# EasyEDA schematic Lesson1.2.json
TITLE: Sheet_1; REV: 1.0; Date: 2022-12-04; Sheet: 1/1; Company: Your Company
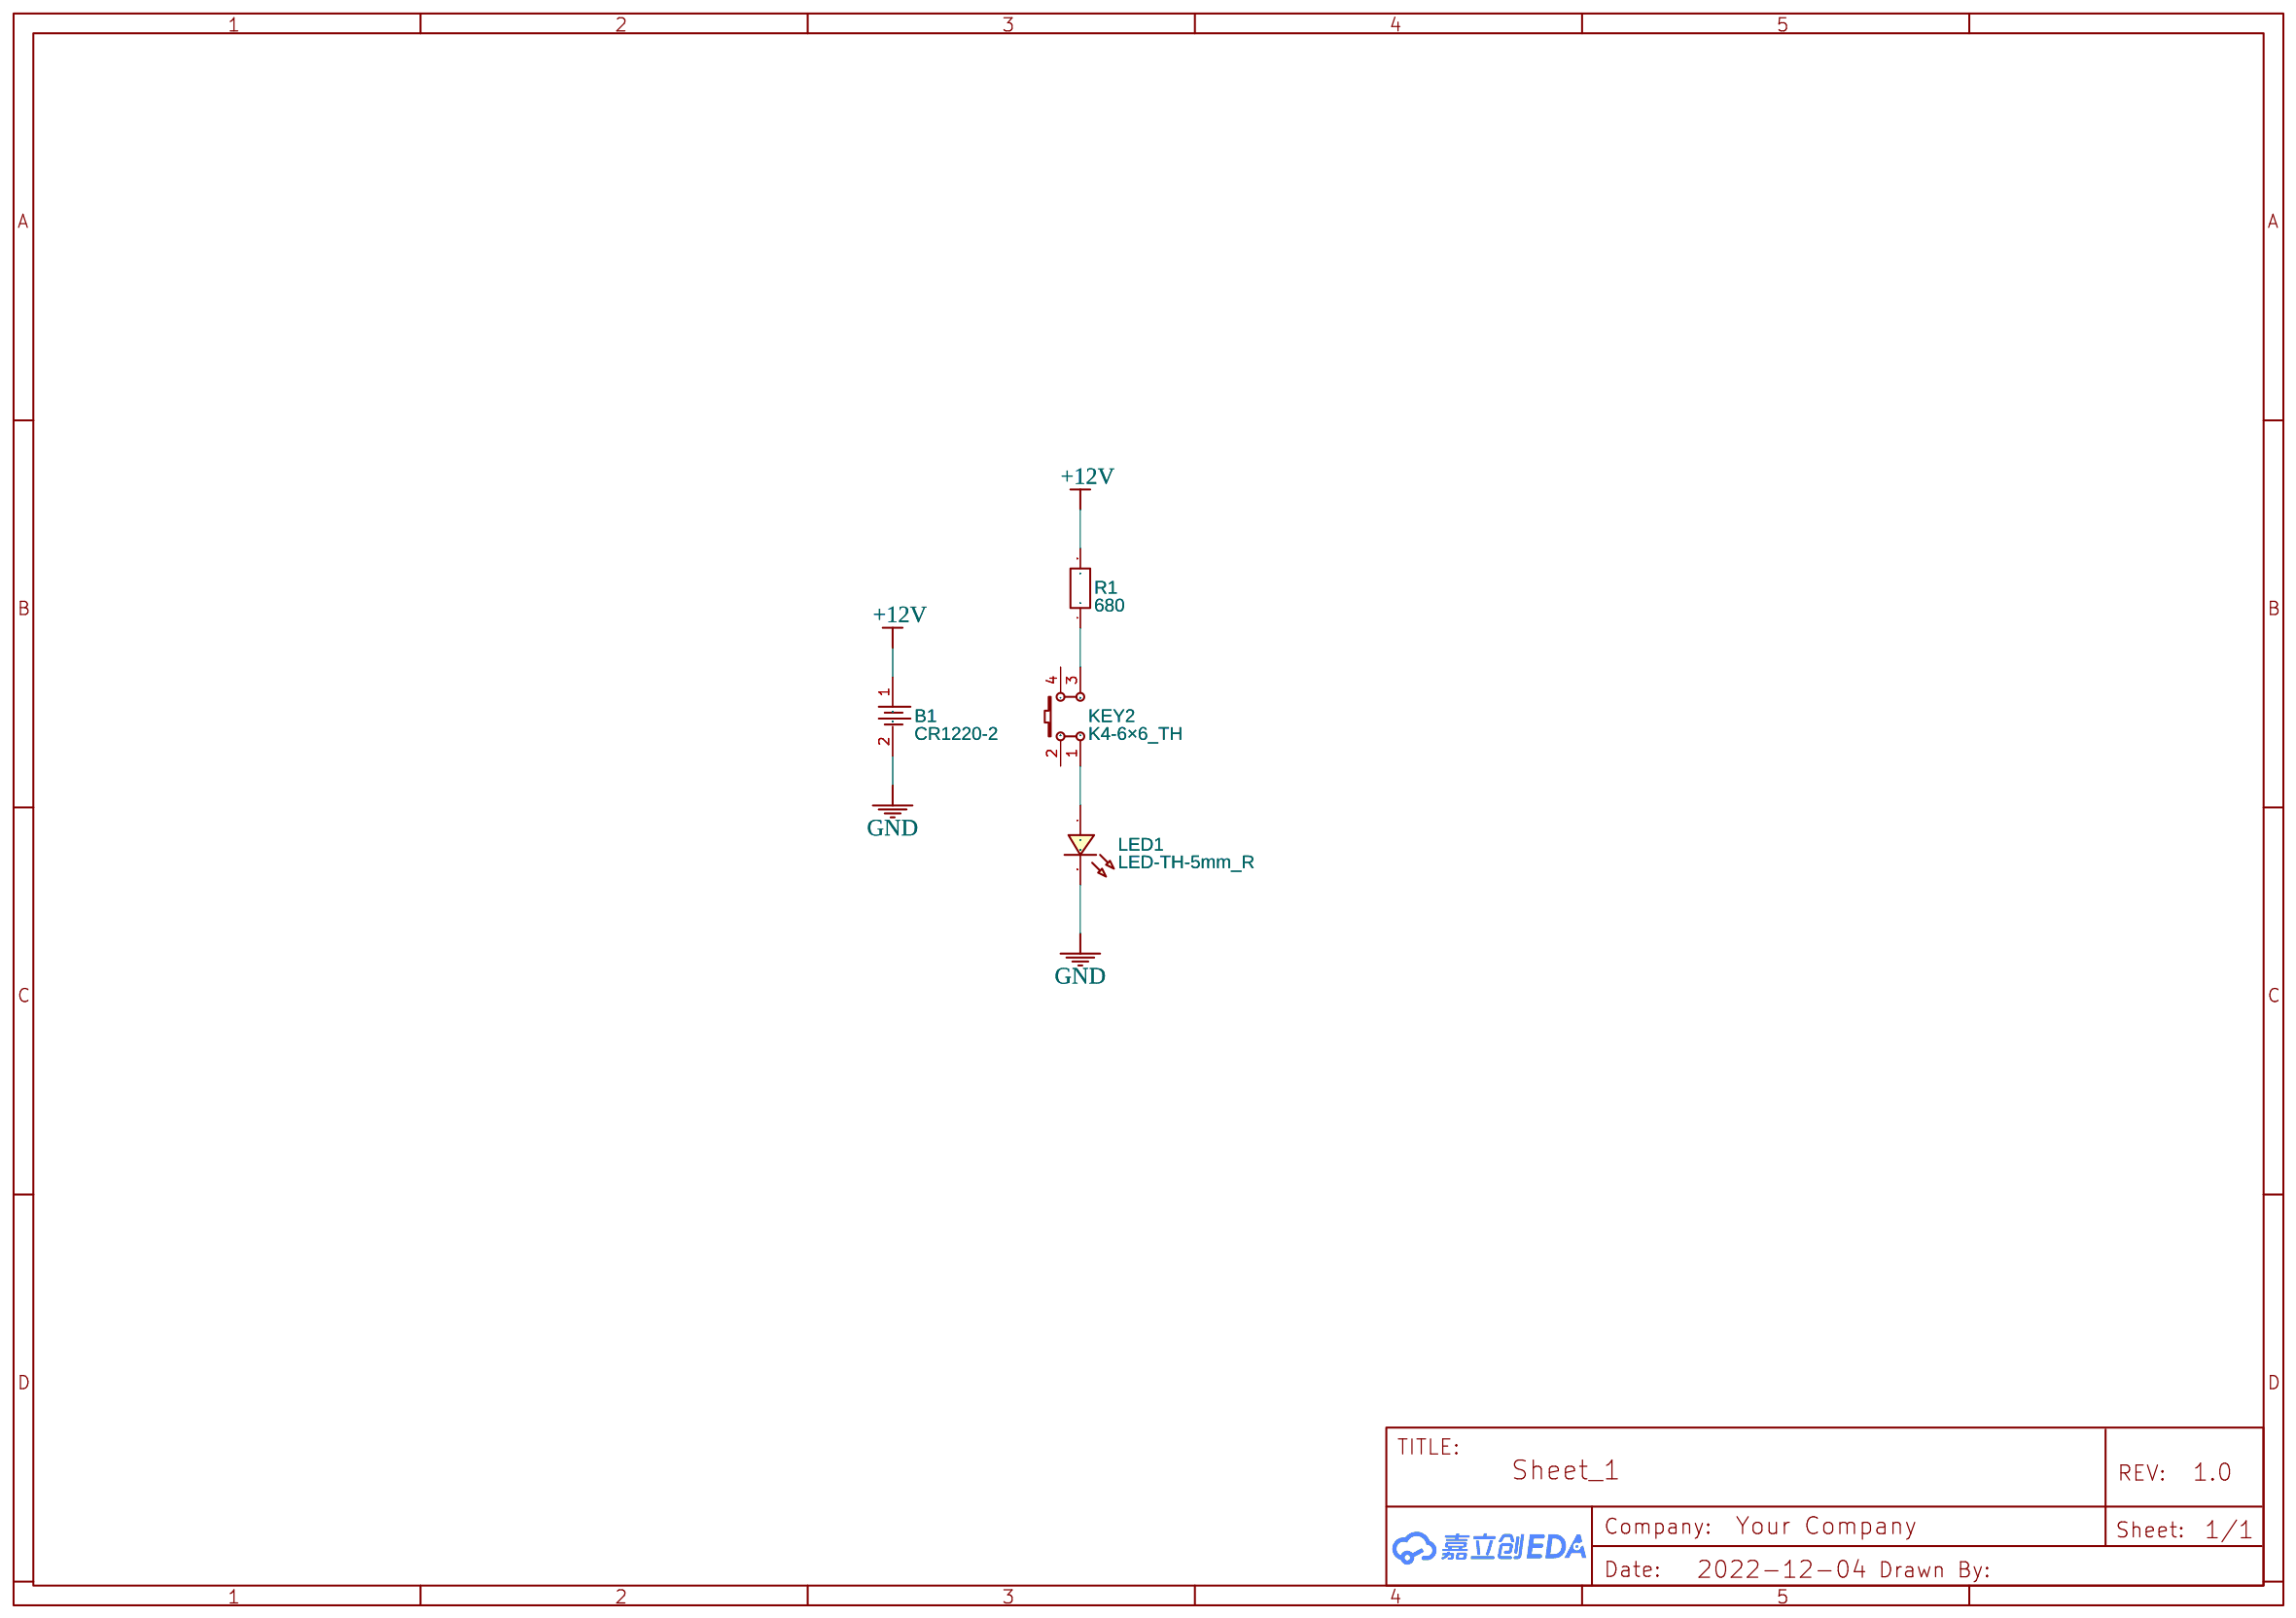
[diagram p0: schematic sheet]

## Parts
B1  CR1220-2  [BAT-SMD_CR1220-2]
KEY2  K4-6×6_TH  [KEY-TH_4P-L6.0-W6.0-P4.50-LS6.5]
LED1  LED-TH-5mm_R  [LED-TH_BD5.0_RED]
R1  680  [R_AXIAL-1.0]

## Library data of the parts
B1 = CR1220-2: Supplier: LCSC; Manufacturer: Q&J; image: //image.lceda.cn/szlcsc/C70381.jpg; Supplier Part: C70381
KEY2 = K4-6×6_TH: Supplier: LCSC; Supplier Part: C136684; Manufacturer: 韩国韩荣; Manufacturer Part: K2-1102DP-E4SW-04; Contributor: LCEDA_Lib
LED1 = LED-TH-5mm_R: Manufacturer: EVERLIGHT(台湾亿光); Manufacturer Part: 333-2SURD/S530-A3; Supplier Part: C87271; Supplier: LCSC; Contributor: LCEDA_Lib
R1 = R_AXIAL-1.0_EU: Contributor: LCEDA_Lib

## Nets
+12V: B1.1 R1.2
GND: B1.2 LED1.2
Net-(KEY2-1): KEY2.1 LED1.1
Net-(KEY2-3): KEY2.3 R1.1

Not connected (* = marked no-connect by the designer): KEY2 2 4
